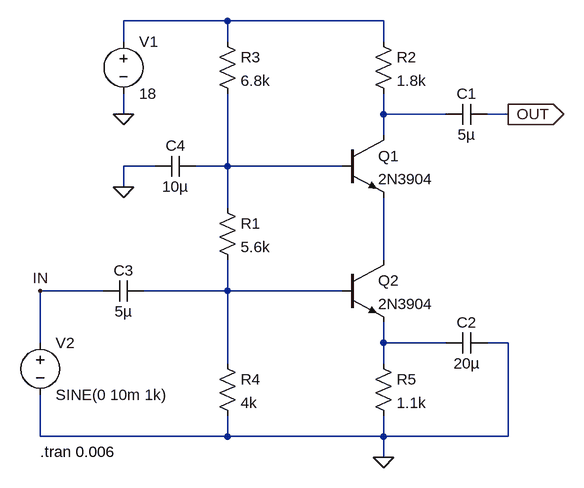
[diagram p0: schematic task.asc]
task.asc, the LTspice schematic file:
Version 4
SHEET 1 880 680
WIRE -64 -224 -224 -224
WIRE 176 -224 -64 -224
WIRE -224 -192 -224 -224
WIRE -64 -192 -64 -224
WIRE 176 -192 176 -224
WIRE -224 -80 -224 -112
WIRE 176 -80 176 -112
WIRE 272 -80 176 -80
WIRE 368 -80 336 -80
WIRE 176 -48 176 -80
WIRE -176 0 -224 0
WIRE -64 0 -64 -112
WIRE -64 0 -112 0
WIRE 112 0 -64 0
WIRE -224 32 -224 0
WIRE -64 64 -64 0
WIRE 176 144 176 48
WIRE -256 192 -352 192
WIRE -64 192 -64 144
WIRE -64 192 -192 192
WIRE 112 192 -64 192
WIRE -352 272 -352 192
WIRE 176 272 176 240
WIRE 272 272 176 272
WIRE 368 272 336 272
WIRE -64 304 -64 192
WIRE 176 304 176 272
WIRE -352 416 -352 352
WIRE -64 416 -64 384
WIRE -64 416 -352 416
WIRE 176 416 176 384
WIRE 176 416 -64 416
WIRE 368 416 368 272
WIRE 368 416 176 416
WIRE 176 448 176 416
FLAG 176 448 0
FLAG -224 -80 0
FLAG -224 32 0
FLAG -352 192 IN
FLAG 368 -80 OUT
IOPIN 368 -80 Out
SYMBOL npn 112 -48 R0
SYMATTR InstName Q1
SYMATTR Value 2N3904
SYMBOL npn 112 144 R0
SYMATTR InstName Q2
SYMATTR Value 2N3904
SYMBOL res -80 48 R0
SYMATTR InstName R1
SYMATTR Value 5.6k
SYMBOL res 160 -208 R0
SYMATTR InstName R2
SYMATTR Value 1.8k
SYMBOL res -80 -208 R0
SYMATTR InstName R3
SYMATTR Value 6.8k
SYMBOL cap 336 -96 R90
WINDOW 0 0 32 VBottom 2
WINDOW 3 32 32 VTop 2
SYMATTR InstName C1
SYMATTR Value 5µ
SYMBOL voltage -224 -208 R0
SYMATTR InstName V1
SYMATTR Value 18
SYMBOL res -80 288 R0
SYMATTR InstName R4
SYMATTR Value 4k
SYMBOL res 160 288 R0
SYMATTR InstName R5
SYMATTR Value 1.1k
SYMBOL cap 336 256 R90
WINDOW 0 0 32 VBottom 2
WINDOW 3 32 32 VTop 2
SYMATTR InstName C2
SYMATTR Value 20µ
SYMBOL cap -192 176 R90
WINDOW 0 0 32 VBottom 2
WINDOW 3 32 32 VTop 2
SYMATTR InstName C3
SYMATTR Value 5µ
SYMBOL voltage -352 256 R0
WINDOW 123 0 0 Left 0
WINDOW 39 0 0 Left 0
SYMATTR InstName V2
SYMATTR Value SINE(0 10m 1k)
SYMBOL cap -112 -16 R90
WINDOW 0 0 32 VBottom 2
WINDOW 3 32 32 VTop 2
SYMATTR InstName C4
SYMATTR Value 10µ
TEXT -352 440 Left 2 !.tran 0.006

The netlist it stands for:
* task.asc
Q1 N002 N003 N004 0 2N3904
Q2 N004 N005 N006 0 2N3904
R1 N003 N005 5.6k
R2 N001 N002 1.8k
R3 N001 N003 6.8k
C1 OUT N002 5µ
V1 N001 0 18
R4 N005 0 4k
R5 N006 0 1.1k
C2 0 N006 20µ
C3 N005 IN 5µ
V2 IN 0 SINE(0 10m 1k)
C4 N003 0 10µ
.model NPN NPN
.model PNP PNP
.lib standard.bjt
.tran 0.006
.backanno
.end

* Results of the author's LTspice run, read from the files saved beside the schematic
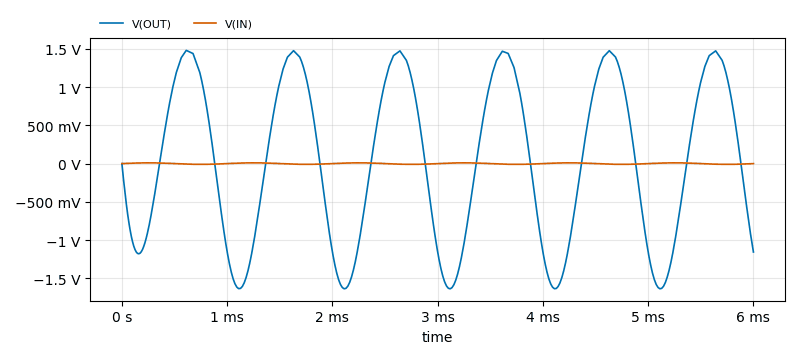
[diagram p1: Transient Analysis of task.asc, plotted from the saved traces]
* Transient Analysis, 1 run:
*   V(OUT): min -1.638 V, max 1.482 V, average 24.7 mV, rms 1.076 V, last -1.157 V
*   V(IN): min -9.994 mV, max 10 mV, average 11.91 µV, rms 7.07 mV, last 0 V